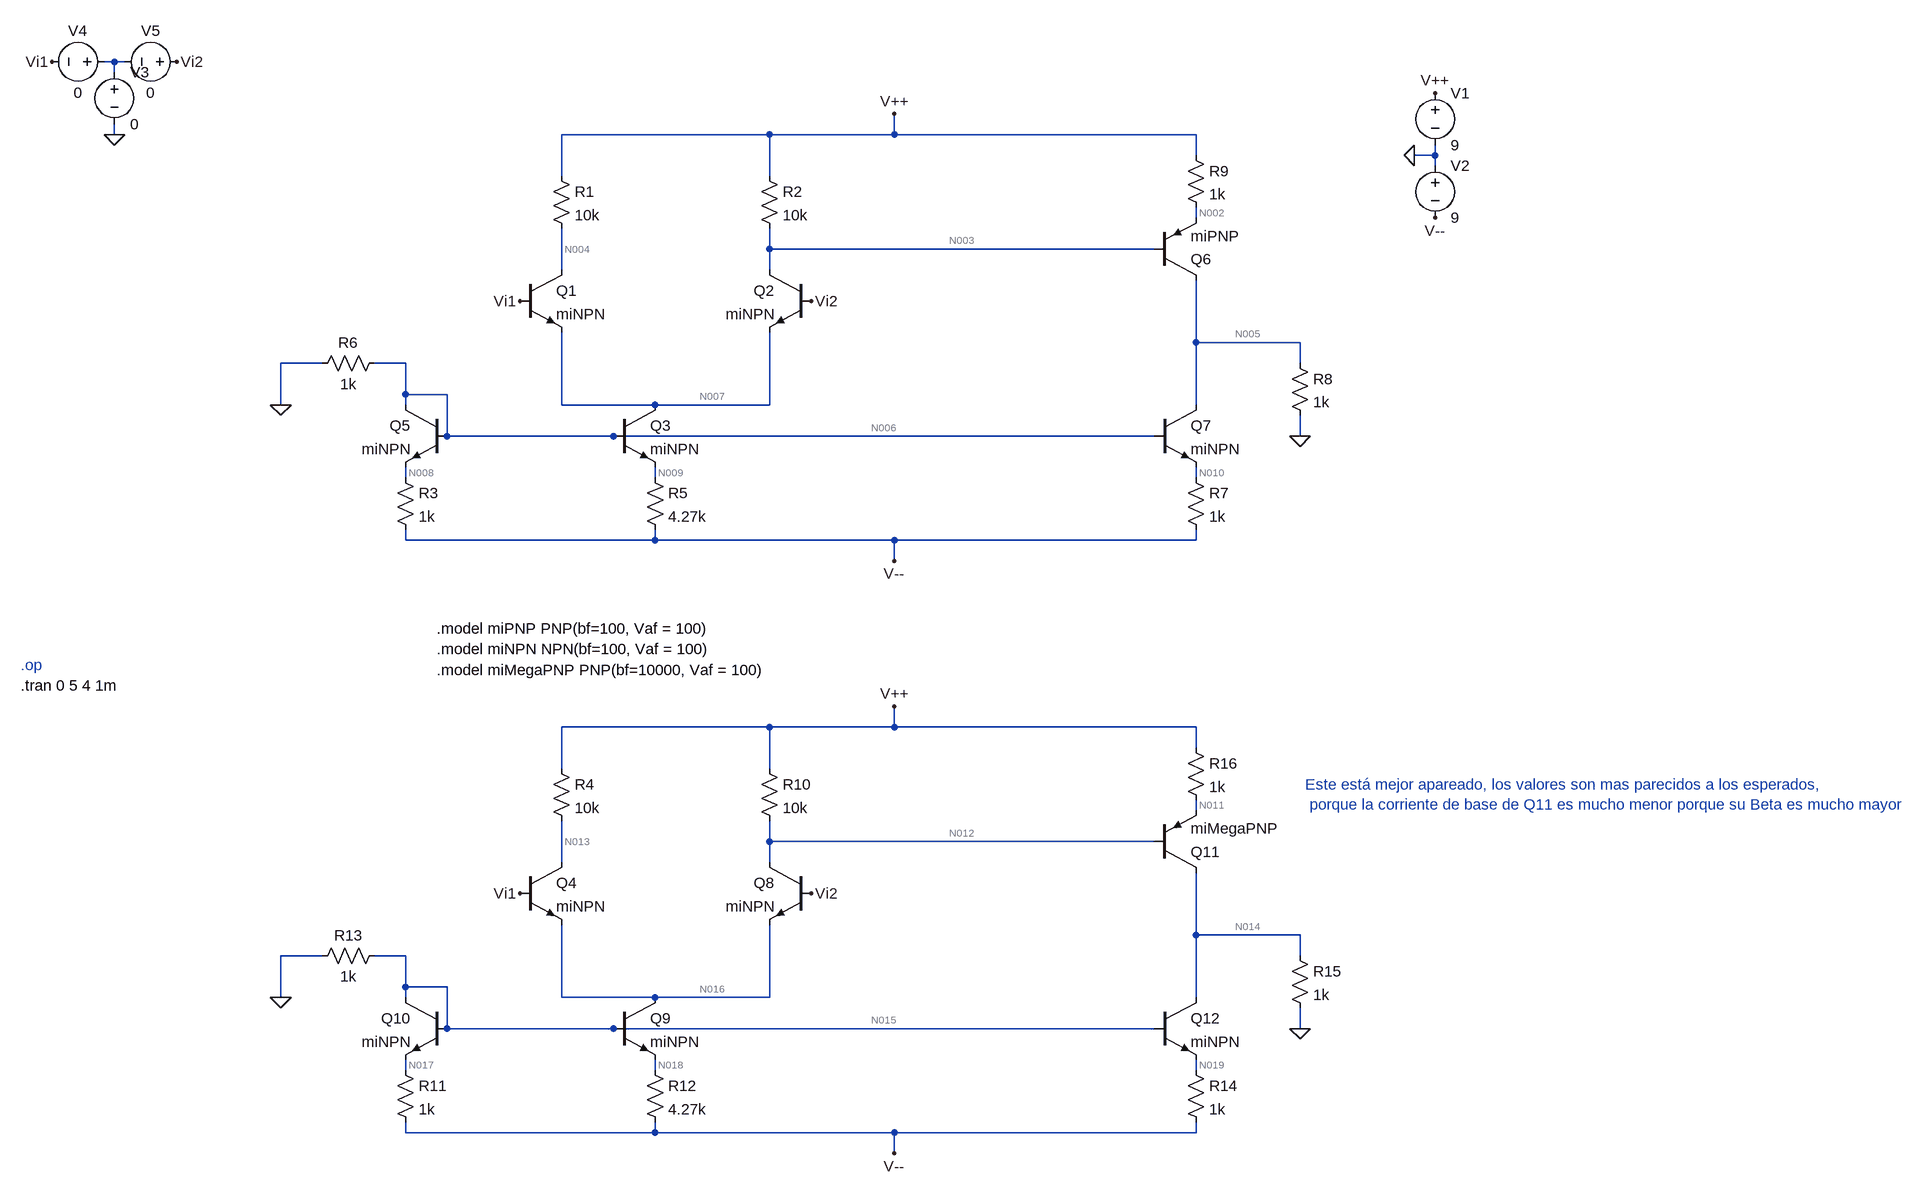
[diagram p0: schematic simu_mi_final.asc]
simu_mi_final.asc, the LTspice schematic file:
Version 4
SHEET 1 3052 1552
WIRE -608 -208 -624 -208
WIRE -592 -208 -608 -208
WIRE -608 -192 -608 -208
WIRE -608 -96 -608 -112
WIRE 400 -96 80 -96
WIRE 592 -96 592 -128
WIRE 592 -96 400 -96
WIRE 1056 -96 592 -96
WIRE 1056 -64 1056 -96
WIRE 1424 -64 1424 -80
WIRE 1424 -64 1392 -64
WIRE 1424 -48 1424 -64
WIRE 80 -32 80 -96
WIRE 400 -32 400 -96
WIRE 1056 32 1056 16
WIRE 400 80 400 48
WIRE 992 80 400 80
WIRE 80 112 80 48
WIRE 400 112 400 80
WIRE 1056 224 1056 128
WIRE 1216 224 1056 224
WIRE -288 256 -352 256
WIRE -160 256 -208 256
WIRE 1216 256 1216 224
WIRE -160 304 -160 256
WIRE -96 304 -160 304
WIRE -352 320 -352 256
WIRE -160 320 -160 304
WIRE 80 320 80 208
WIRE 224 320 80 320
WIRE 400 320 400 208
WIRE 400 320 224 320
WIRE 1056 320 1056 224
WIRE -96 368 -96 304
WIRE 160 368 -96 368
WIRE 992 368 160 368
WIRE 1216 368 1216 336
WIRE -160 432 -160 416
WIRE 224 432 224 416
WIRE 1056 432 1056 416
WIRE -160 528 -160 512
WIRE 224 528 224 512
WIRE 224 528 -160 528
WIRE 592 528 224 528
WIRE 1056 528 1056 512
WIRE 1056 528 592 528
WIRE 592 560 592 528
WIRE 400 816 80 816
WIRE 592 816 592 784
WIRE 592 816 400 816
WIRE 1056 816 592 816
WIRE 1056 848 1056 816
WIRE 80 880 80 816
WIRE 400 880 400 816
WIRE 1056 944 1056 928
WIRE 400 992 400 960
WIRE 992 992 400 992
WIRE 80 1024 80 960
WIRE 400 1024 400 992
WIRE 1056 1136 1056 1040
WIRE 1216 1136 1056 1136
WIRE -288 1168 -352 1168
WIRE -160 1168 -208 1168
WIRE 1216 1168 1216 1136
WIRE -160 1216 -160 1168
WIRE -96 1216 -160 1216
WIRE -352 1232 -352 1168
WIRE -160 1232 -160 1216
WIRE 80 1232 80 1120
WIRE 224 1232 80 1232
WIRE 400 1232 400 1120
WIRE 400 1232 224 1232
WIRE 1056 1232 1056 1136
WIRE -96 1280 -96 1216
WIRE 160 1280 -96 1280
WIRE 992 1280 160 1280
WIRE 1216 1280 1216 1248
WIRE -160 1344 -160 1328
WIRE 224 1344 224 1328
WIRE 1056 1344 1056 1328
WIRE -160 1440 -160 1424
WIRE 224 1440 224 1424
WIRE 224 1440 -160 1440
WIRE 592 1440 224 1440
WIRE 1056 1440 1056 1424
WIRE 1056 1440 592 1440
WIRE 592 1472 592 1440
FLAG 1392 -64 0
FLAG 1216 368 0
FLAG -352 320 0
FLAG 1424 -160 V++
FLAG 592 -128 V++
FLAG 1424 32 V--
FLAG 592 560 V--
FLAG -608 -96 0
FLAG -704 -208 Vi1
FLAG 16 160 Vi1
FLAG -512 -208 Vi2
FLAG 464 160 Vi2
FLAG 1216 1280 0
FLAG -352 1232 0
FLAG 592 784 V++
FLAG 592 1472 V--
FLAG 16 1072 Vi1
FLAG 464 1072 Vi2
SYMBOL npn 16 112 R0
SYMATTR InstName Q1
SYMATTR Value miNPN
SYMBOL npn 464 112 M0
SYMATTR InstName Q2
SYMATTR Value miNPN
SYMBOL res 64 -48 R0
SYMATTR InstName R1
SYMATTR Value 10k
SYMBOL res 384 -48 R0
SYMATTR InstName R2
SYMATTR Value 10k
SYMBOL npn 160 320 R0
SYMATTR InstName Q3
SYMATTR Value miNPN
SYMBOL npn -96 320 M0
SYMATTR InstName Q5
SYMATTR Value miNPN
SYMBOL res -176 416 R0
SYMATTR InstName R3
SYMATTR Value 1k
SYMBOL res 208 416 R0
SYMATTR InstName R5
SYMATTR Value 4.27k
SYMBOL res -192 240 R90
WINDOW 0 0 56 VBottom 2
WINDOW 3 32 56 VTop 2
SYMATTR InstName R6
SYMATTR Value 1k
SYMBOL pnp 992 128 M180
SYMATTR InstName Q6
SYMATTR Value miPNP
SYMBOL npn 992 320 R0
SYMATTR InstName Q7
SYMATTR Value miNPN
SYMBOL res 1040 416 R0
SYMATTR InstName R7
SYMATTR Value 1k
SYMBOL res 1200 240 R0
SYMATTR InstName R8
SYMATTR Value 1k
SYMBOL res 1040 -80 R0
SYMATTR InstName R9
SYMATTR Value 1k
SYMBOL voltage 1424 -176 R0
WINDOW 123 0 0 Left 0
WINDOW 39 0 0 Left 0
SYMATTR InstName V1
SYMATTR Value 9
SYMBOL voltage 1424 -64 R0
WINDOW 123 0 0 Left 0
WINDOW 39 0 0 Left 0
SYMATTR InstName V2
SYMATTR Value 9
SYMBOL voltage -608 -208 R0
WINDOW 123 0 0 Left 0
WINDOW 39 0 0 Left 0
SYMATTR InstName V3
SYMATTR Value 0
SYMBOL voltage -608 -208 R90
WINDOW 0 -32 56 VBottom 2
WINDOW 3 32 56 VTop 2
WINDOW 123 0 0 Left 0
WINDOW 39 0 0 Left 0
SYMATTR InstName V4
SYMATTR Value 0
SYMBOL voltage -496 -208 R90
WINDOW 0 -32 56 VBottom 2
WINDOW 3 32 56 VTop 2
WINDOW 123 0 0 Left 0
WINDOW 39 0 0 Left 0
SYMATTR InstName V5
SYMATTR Value 0
SYMBOL npn 16 1024 R0
SYMATTR InstName Q4
SYMATTR Value miNPN
SYMBOL npn 464 1024 M0
SYMATTR InstName Q8
SYMATTR Value miNPN
SYMBOL res 64 864 R0
SYMATTR InstName R4
SYMATTR Value 10k
SYMBOL res 384 864 R0
SYMATTR InstName R10
SYMATTR Value 10k
SYMBOL npn 160 1232 R0
SYMATTR InstName Q9
SYMATTR Value miNPN
SYMBOL npn -96 1232 M0
SYMATTR InstName Q10
SYMATTR Value miNPN
SYMBOL res -176 1328 R0
SYMATTR InstName R11
SYMATTR Value 1k
SYMBOL res 208 1328 R0
SYMATTR InstName R12
SYMATTR Value 4.27k
SYMBOL res -192 1152 R90
WINDOW 0 0 56 VBottom 2
WINDOW 3 32 56 VTop 2
SYMATTR InstName R13
SYMATTR Value 1k
SYMBOL pnp 992 1040 M180
SYMATTR InstName Q11
SYMATTR Value miMegaPNP
SYMBOL npn 992 1232 R0
SYMATTR InstName Q12
SYMATTR Value miNPN
SYMBOL res 1040 1328 R0
SYMATTR InstName R14
SYMATTR Value 1k
SYMBOL res 1200 1152 R0
SYMATTR InstName R15
SYMATTR Value 1k
SYMBOL res 1040 832 R0
SYMATTR InstName R16
SYMATTR Value 1k
TEXT -112 664 Left 2 !.model miPNP PNP(bf=100, Vaf = 100)
TEXT -112 696 Left 2 !.model miNPN NPN(bf=100, Vaf = 100)
TEXT -752 720 Left 2 ;.op
TEXT -752 752 Left 2 !.tran 0 5 4 1m
TEXT -112 728 Left 2 !.model miMegaPNP PNP(bf=10000, Vaf = 100)
TEXT 1224 904 Left 2 ;Este está mejor apareado, los valores son mas parecidos a los esperados,\n porque la corriente de base de Q11 es mucho menor porque su Beta es mucho mayor

The netlist it stands for:
* simu_mi_final.asc
Q1 N004 Vi1 N007 0 miNPN
Q2 N003 Vi2 N007 0 miNPN
R1 V++ N004 10k
R2 V++ N003 10k
Q3 N007 N006 N009 0 miNPN
Q5 N006 N006 N008 0 miNPN
R3 N008 V-- 1k
R5 N009 V-- 4.27k
R6 N006 0 1k
Q6 N005 N003 N002 0 miPNP
Q7 N005 N006 N010 0 miNPN
R7 N010 V-- 1k
R8 N005 0 1k
R9 V++ N002 1k
V1 V++ 0 9
V2 0 V-- 9
V3 N001 0 0
V4 N001 Vi1 0
V5 Vi2 N001 0
Q4 N013 Vi1 N016 0 miNPN
Q8 N012 Vi2 N016 0 miNPN
R4 V++ N013 10k
R10 V++ N012 10k
Q9 N016 N015 N018 0 miNPN
Q10 N015 N015 N017 0 miNPN
R11 N017 V-- 1k
R12 N018 V-- 4.27k
R13 N015 0 1k
Q11 N014 N012 N011 0 miMegaPNP
Q12 N014 N015 N019 0 miNPN
R14 N019 V-- 1k
R15 N014 0 1k
R16 V++ N011 1k
.model NPN NPN
.model PNP PNP
.lib standard.bjt
.model miPNP PNP(bf=100, Vaf = 100)
.model miNPN NPN(bf=100, Vaf = 100)
* .op
.tran 0 5 4 1m
.model miMegaPNP PNP(bf=10000, Vaf = 100)
* Este está mejor apareado, los valores son mas parecidos a los esperados,
*  porque la corriente de base de Q11 es mucho menor porque su Beta es mucho mayor
.backanno
.end

* Results of the author's LTspice run, read from the files saved beside the schematic
* Operating Point, zero values left out:
*   V(n004) = 4.285 V
*   V(n007) = -754.8 mV
*   V(n003) = 4.637 V
*   V(v++) = 9 V
*   V(n006) = -4.12 V
*   V(n009) = -4.893 V
*   V(n008) = -4.93 V
*   V(v--) = -9 V
*   V(n005) = -508.8 mV
*   V(n002) = 5.444 V
*   V(n010) = -4.93 V
*   V(n013) = 4.285 V
*   V(n016) = -754.8 mV
*   V(n012) = 4.289 V
*   V(n015) = -4.12 V
*   V(n018) = -4.893 V
*   V(n017) = -4.93 V
*   V(n014) = -128.7 mV
*   V(n011) = 5.099 V
*   V(n019) = -4.93 V
*   Ic(Q1) = 471.5 µA
*   Ib(Q1) = 4.713 µA
*   Ie(Q1) = -476.2 µA
*   Ic(Q2) = 471.5 µA
*   Ib(Q2) = 4.713 µA
*   Ie(Q2) = -476.2 µA
*   Ic(Q3) = 952.4 µA
*   Ib(Q3) = 9.521 µA
*   Ie(Q3) = -961.9 µA
*   Ic(Q5) = 4.03 mA
*   Ib(Q5) = 40.3 µA
*   Ie(Q5) = -4.07 mA
*   Ic(Q7) = 4.03 mA
*   Ib(Q7) = 40.28 µA
*   Ie(Q7) = -4.07 mA
*   Ic(Q4) = 471.5 µA
*   Ib(Q4) = 4.713 µA
*   Ie(Q4) = -476.2 µA
*   Ic(Q8) = 471.5 µA
*   Ib(Q8) = 4.713 µA
*   Ie(Q8) = -476.2 µA
*   Ic(Q9) = 952.4 µA
*   Ib(Q9) = 9.521 µA
*   Ie(Q9) = -961.9 µA
*   Ic(Q10) = 4.03 mA
*   Ib(Q10) = 40.3 µA
*   Ie(Q10) = -4.07 mA
*   Ic(Q12) = 4.03 mA
*   Ib(Q12) = 40.28 µA
*   Ie(Q12) = -4.07 mA
*   Ic(Q6) = -3.521 mA
*   Ib(Q6) = -35.19 µA
*   Ie(Q6) = 3.556 mA
*   Ic(Q11) = -3.901 mA
*   Ib(Q11) = -389.9 nA
*   Ie(Q11) = 3.901 mA
*   I(R1) = 471.5 µA
*   I(R2) = 436.3 µA
*   I(R3) = 4.07 mA
*   I(R5) = 961.9 µA
*   I(R6) = -4.12 mA
*   I(R7) = 4.07 mA
*   I(R8) = -508.8 µA
*   I(R9) = 3.556 mA
*   I(R4) = 471.5 µA
*   I(R10) = 471.1 µA
*   I(R11) = 4.07 mA
*   I(R12) = 961.9 µA
*   I(R13) = -4.12 mA
*   I(R14) = 4.07 mA
*   I(R15) = -128.7 µA
*   I(R16) = 3.901 mA
*   I(V1) = -9.308 mA
*   I(V2) = -18.2 mA
*   I(V3) = -18.85 µA
*   I(V4) = 9.425 µA
*   I(V5) = -9.425 µA